# Altium project USBC.PrjPcb
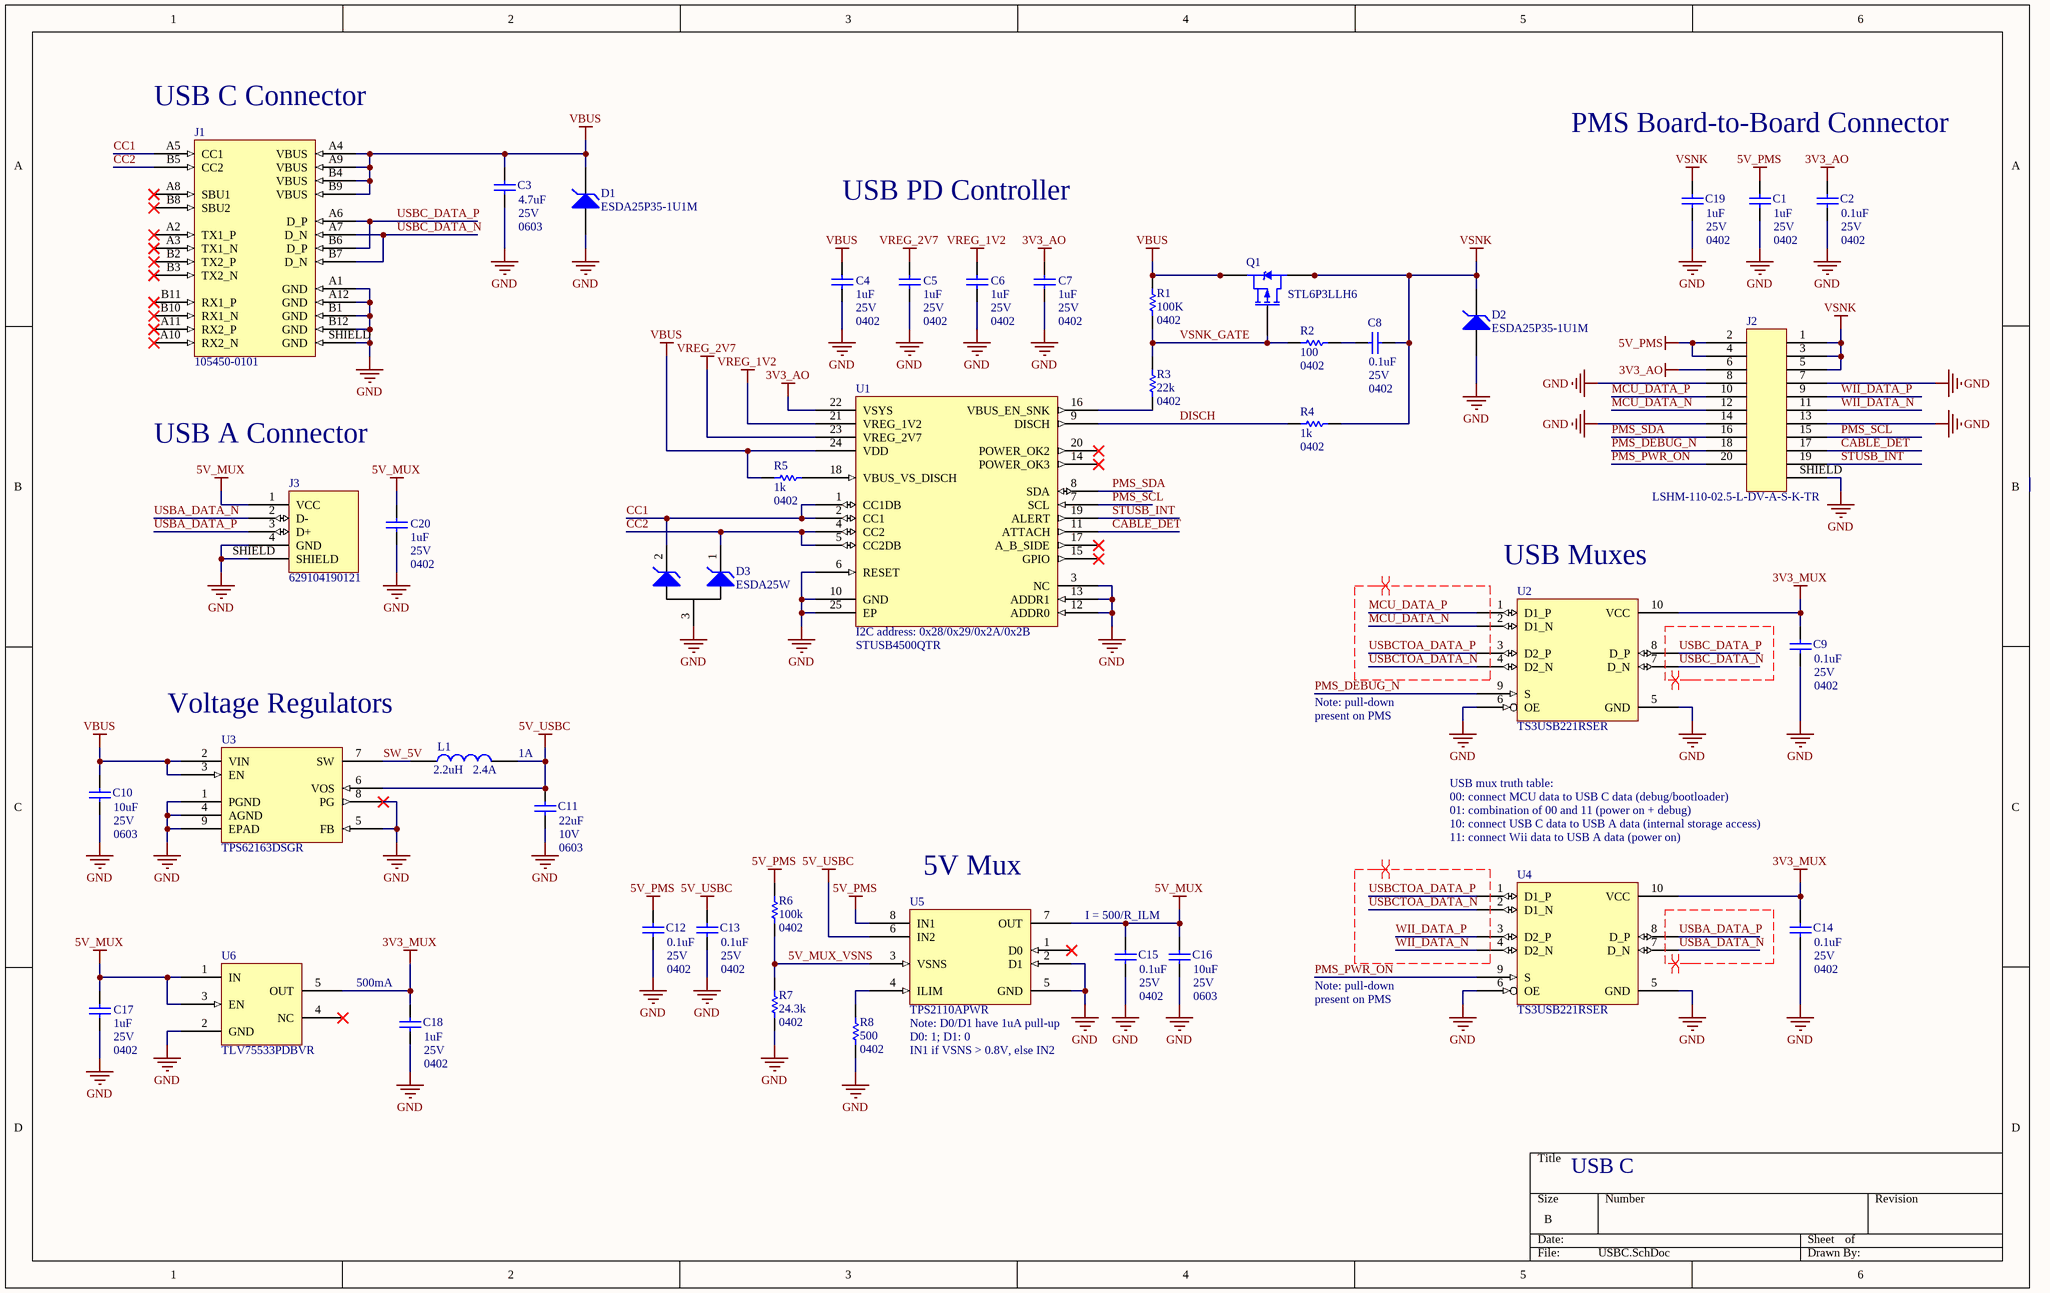
[diagram p0: USBC.SchDoc]
1 sheet, 42 parts. Net scope: global (net labels, ports and power ports of the same name join across sheets).
Board file: USBC.PcbDoc

## Sheet USBC.SchDoc
size B

### Parts
C1  value 1uF  Rated Voltage: 25V  Package: 0402  [CAPC1005X06N]  (hidden comment: Capacitor)
C2  value 0.1uF  Rated Voltage: 25V  Package: 0402  [CAPC1005X06N]  (hidden comment: Capacitor)
C3  value 4.7uF  Rated Voltage: 25V  Package: 0603  [CAPC1608X09N]  (hidden comment: Capacitor)
C4  value 1uF  Rated Voltage: 25V  Package: 0402  [CAPC1005X06N]  (hidden comment: Capacitor)
C5  value 1uF  Rated Voltage: 25V  Package: 0402  [CAPC1005X06N]  (hidden comment: Capacitor)
C6  value 1uF  Rated Voltage: 25V  Package: 0402  [CAPC1005X06N]  (hidden comment: Capacitor)
C7  value 1uF  Rated Voltage: 25V  Package: 0402  [CAPC1005X06N]  (hidden comment: Capacitor)
C8  value 0.1uF  Rated Voltage: 25V  Package: 0402  [CAPC1005X06N]  (hidden comment: Capacitor)
C9  value 0.1uF  Rated Voltage: 25V  Package: 0402  [CAPC1005X06N]  (hidden comment: Capacitor)
C10  value 10uF  Rated Voltage: 25V  Package: 0603  [CAPC1608X09N]  (hidden comment: Capacitor)
C11  value 22uF  Rated Voltage: 10V  Package: 0603  [CAPC1608X09N]  (hidden comment: Capacitor)
C12  value 0.1uF  Rated Voltage: 25V  Package: 0402  [CAPC1005X06N]  (hidden comment: Capacitor)
C13  value 0.1uF  Rated Voltage: 25V  Package: 0402  [CAPC1005X06N]  (hidden comment: Capacitor)
C14  value 0.1uF  Rated Voltage: 25V  Package: 0402  [CAPC1005X06N]  (hidden comment: Capacitor)
C15  value 0.1uF  Rated Voltage: 25V  Package: 0402  [CAPC1005X06N]  (hidden comment: Capacitor)
C16  value 10uF  Rated Voltage: 25V  Package: 0603  [CAPC1608X09N]  (hidden comment: Capacitor)
C17  value 1uF  Rated Voltage: 25V  Package: 0402  [CAPC1005X06N]  (hidden comment: Capacitor)
C18  value 1uF  Rated Voltage: 25V  Package: 0402  [CAPC1005X06N]  (hidden comment: Capacitor)
C19  value 1uF  Rated Voltage: 25V  Package: 0402  [CAPC1005X06N]  (hidden comment: Capacitor)
C20  value 1uF  Rated Voltage: 25V  Package: 0402  [CAPC1005X06N]  (hidden comment: Capacitor)
D1  ESDA25P35-1U1M  [DFN105P160X60-2N]
D2  ESDA25P35-1U1M  [DFN105P160X60-2N]
D3  ESDA25W  [SOT65P210X110-3N]
J1  105450-0101  [1054500101]
J2  LSHM-110-02.5-L-DV-A-S-K-TR  [LSHM-110-02.5-L-DV-A-S]
J3  629104190121  [629104190121]
L1  Current Rating: 2.4A  Inductance: 2.2uH  [INDC2520X10N]  (hidden comment: CIGT252010EH2R2MNE)
Q1  STL6P3LLH6  [QFN0P315X300X90-10N]
R1  value 100K  Package: 0402  [RESC1005X04N]  (hidden comment: Resistor)
R2  value 100  Package: 0402  [RESC1005X04N]  (hidden comment: Resistor)
R3  value 22k  Package: 0402  [RESC1005X04N]  (hidden comment: Resistor)
R4  value 1k  Package: 0402  [RESC1005X04N]  (hidden comment: Resistor)
R5  value 1k  Package: 0402  [RESC1005X04N]  (hidden comment: Resistor)
R6  value 100k  Package: 0402  [RESC1005X04N]  (hidden comment: Resistor)
R7  value 24.3k  Package: 0402  [RESC1005X04N]  (hidden comment: Resistor)
R8  value 500  Package: 0402  [RESC1005X04N]  (hidden comment: Resistor)
U1  STUSB4500QTR  [QFN50P400X400X100_HS-25N]
U2  TS3USB221RSER  [QFN50P150X200X60-10N]
U3  TPS62163DSGR  [SON50P200X80_HS-9N]
U4  TS3USB221RSER  [QFN50P150X200X60-10N]
U5  TPS2110APWR  [TSOP65P640X120-8N]
U6  TLV75533PDBVR  [SOT95P280X145-5N]

### Nets
3V3_AO: C2.2 C7.2 J2.6 U1.22(VSYS)
3V3_MUX: C9.2 C14.2 C18.2 U2.10(VCC) U4.10(VCC) U6.5(OUT)
5V_MUX: C15.2 C16.2 C17.2 C20.2 J3.1(VCC) U5.7(OUT) U6.1(IN) U6.3(EN)
5V_PMS: C1.2 C12.2 J2.2 J2.4 R6.2 U5.8(IN1)
5V_USBC: C11.2 C13.2 L1.2 U3.6(VOS) U5.6(IN2)
GND: C1.1 C2.1 C3.1 C4.1 C5.1 C6.1 C7.1 C9.1 C10.1 C11.1 C12.1 C13.1 C14.1 C15.1 C16.1 C17.1 C18.1 C19.1 C20.1 D1.2(A) D2.2(A) D3.3(A) J1.A1(GND) J1.A12(GND) J1.B1(GND) J1.B12(GND) J1.SHIELD(GND) J2.7 J2.8 J2.13 J2.14 J2.SHIELD J3.4(GND) J3.SHIELD R7.1 R8.1 U1.3(NC) U1.6(RESET) U1.10(GND) U1.12(ADDR0) U1.13(ADDR1) U1.25(EP) U2.5(GND) U2.6(OE) U3.1(PGND) U3.4(AGND) U3.5(FB) U3.8(PG) U3.9(EPAD) U4.5(GND) U4.6(OE) U5.2(D1) U5.5(GND) U6.2(GND)
VBUS: C3.2 C4.2 C10.2 D1.1(K) J1.A4(VBUS) J1.A9(VBUS) J1.B4(VBUS) J1.B9(VBUS) Q1.1(S) Q1.2(S) Q1.3(S) R1.2 R5.2 U1.24(VDD) U3.2(VIN) U3.3(EN)
VREG_1V2: C6.2 U1.21(VREG_1V2)
VREG_2V7: C5.2 U1.23(VREG_2V7)
VSNK: C8.1 C19.2 D2.1(K) J2.1 J2.3 J2.5 Q1.5(D) Q1.6(D) Q1.7(D) Q1.8(D) R4.1
5V_MUX_VSNS: R6.1 R7.2 U5.3(VSNS)
CABLE_DET: J2.17 U1.11(ATTACH)
CC1: D3.2(K2) J1.A5(CC1) U1.1(CC1DB) U1.2(CC1)
CC2: D3.1(K1) J1.B5(CC2) U1.4(CC2) U1.5(CC2DB)
DISCH: R4.2 U1.9(DISCH)
MCU_DATA_N: J2.12 U2.2(D1_N)
MCU_DATA_P: J2.10 U2.1(D1_P)
PMS_DEBUG_N: J2.18 U2.9(S)
PMS_PWR_ON: J2.20 U4.9(S)
PMS_SCL: J2.15 U1.7(SCL)
PMS_SDA: J2.16 U1.8(SDA)
STUSB_INT: J2.19 U1.19(ALERT)
SW_5V: L1.1 U3.7(SW)
USBA_DATA_N: J3.2(D-) U4.7(D_N)
USBA_DATA_P: J3.3(D+) U4.8(D_P)
USBC_DATA_N: J1.A7(D_N) J1.B7(D_N) U2.7(D_N)
USBC_DATA_P: J1.A6(D_P) J1.B6(D_P) U2.8(D_P)
USBCTOA_DATA_N: U2.4(D2_N) U4.2(D1_N)
USBCTOA_DATA_P: U2.3(D2_P) U4.1(D1_P)
VSNK_GATE: Q1.4(G) R1.1 R2.2 R3.2
WII_DATA_N: J2.11 U4.4(D2_N)
WII_DATA_P: J2.9 U4.3(D2_P)
NetC8_2: C8.2 R2.1
NetR3_1: R3.1 U1.16(VBUS_EN_SNK)
NetR5_1: R5.1 U1.18(VBUS_VS_DISCH)
NetR8_2: R8.2 U5.4(ILIM)

Not connected (* = marked no-connect by the designer): J1 A2(TX1_P)* A3(TX1_N)* A8(SBU1)* A10(RX2_N)* A11(RX2_P)* B2(TX2_P)* B3(TX2_N)* B8(SBU2)* B10(RX1_N)* B11(RX1_P)*; U1 14(POWER_OK3)* 15(GPIO)* 17(A_B_SIDE)* 20(POWER_OK2)*; U5 1(D0)*; U6 4(NC)*

### Layout directives
differential pair: MCU_DATA_N, MCU_DATA_P, USBA_DATA_N, USBA_DATA_P, USBC_DATA_N, USBC_DATA_P, USBCTOA_DATA_N, USBCTOA_DATA_P, WII_DATA_N, WII_DATA_P

### Notes on the sheet
- (near J1) USB C Connector
- PMS Board-to-Board Connector
- USB PD Controller
- USB A Connector
- (near U2) USB Muxes
- Voltage Regulators
- 1A
- Note: pull-down
  present on PMS
- USB mux truth table:
  00: connect MCU data to USB C data (debug/bootloader)
  01: combination of 00 and 11 (power on + debug)
  10: connect USB C data to USB A data (internal storage access)
  11: connect Wii data to USB A data (power on)
- (near U5) 5V Mux
- I = 500/R_ILM
- 500mA
- (near U5) Note: D0/D1 have 1uA pull-up
- D0: 1; D1: 0
- IN1 if VSNS > 0.8V, else IN2
- USB C
- (in symbol STUSB4500QTR) I2C address: 0x28/0x29/0x2A/0x2B

### Library data of the parts
C1-C20 = Capacitor: General purpose capacitor
D1 D2 = ESDA25P35-1U1M: STMICROELECTRONICS - ESDA25P35-1U1M - ESD Protection Device, Unidirectional, 41 V, QFN, 2 Pins; Number of Unidirectional Channels: 1; Reverse Standoff Voltage: 22V; Min Breakdown Voltage: 23.3V; Clamping Voltage: 41V; Peak Pulse Current: 35A; Peak Pulse Power: 1.4kW; Power Line Protection: No; Supplier 1: Digi-Key; Manufacturer: STMicroelectronics; Manufacturer Part Number: ESDA25P35-1U1M; RoHS: No; Category: TVS Diodes; Stock 1: 4234; Pricing 1: 1=0.45000, 10=0.36200, 25=0.33120, 100=0.20790, 250=0.20560, 500=0.19250, 1000=0.13090, 2500=0.12551 (USD); Mount: Surface Mount; Case/Package: 1610; Number of Pins: 2; Min Operating Temperature: -55°C; Max Operating Temperature: 150°C; Composition: Zener; Packaging: Tape and Reel; ComponentLink1URL: http://www.farnell.com/datasheets/2236209.pdf?src-supplier=Farnell; ComponentLink1Description: http://www.farnell.com/datasheets/2236209.pdf?src-supplier=Farnell; ComponentLink2URL: http://www.st.com/content/ccc/resource/technical/document/datasheet/group3/e4/43/53/b9/4e/8a/40/bb/DM00312034/files/DM00312034.pdf/jcr:content/translations/en.DM00312034.pdf?src-supplier=Digi-Key; ComponentLink2Description: http://www.st.com/content/ccc/resource/technical/document/datasheet/group3/e4/43/53/b9/4e/8a/40/bb/DM00312034/files/DM00312034.pdf/jcr:content/translations/en.DM00312034.pdf?src-supplier=Digi-Key; ComponentLink3URL: http://www.farnell.com/datasheets/2236209.pdf?src-supplier=Element14; ComponentLink3Description: http://www.farnell.com/datasheets/2236209.pdf?src-supplier=Element14; ComponentLink4URL: http://www.farnell.com/datasheets/2236209.pdf?src-supplier=Newark; ComponentLink4Description: http://www.farnell.com/datasheets/2236209.pdf?src-supplier=Newark
D3 = ESDA25W: STMICROELECTRONICS - ESDA25W - ESD Protection Device, Array, SOT-323, 3 Pins, 1.2 V, 400 W, ESDA2 Series; Working Voltage: 24V; Direction: Unidirectional; Number of Channels: 2; Min Breakdown Voltage: 25V; Peak Pulse Power: 400W; Power Line Protection: No; Leakage Current: 1uA; ESD Protection: Yes; Test Current: 1mA; Max Breakdown Voltage: 30V; Element Configuration: Common Anode; Capacitance: 65pF; Operating Supply Voltage: 1.2V; Supplier 1: Digi-Key; Manufacturer: STMicroelectronics; Manufacturer Part Number: ESDA25W; RoHS: Yes; Category: Integrated Circuits (ICs); Pricing 1: 1=0.40000, 10=0.32600, 25=0.29800, 100=0.18710, 250=0.18504, 500=0.17326, 1000=0.11781 (USD); Mount: Surface Mount; Case/Package: SOT-323; Number of Pins: 3; Min Operating Temperature: -40°C; Max Operating Temperature: 125°C; Composition: Zener; Number of Unidirectional Channels: 2; Reverse Standoff Voltage: 24V; Polarity: Unidirectional; Breakdown Voltage: 25V; Termination: SMD/SMT; Max Reverse Leakage Current: 1uA; Voltage Rating (DC): 25V; Package Quantity: 1; Packaging: Tape and Reel; Number of Elements: 2; Reverse Breakdown Voltage: 25V; Max Power Dissipation: 400W; Length: 2mm; Height: 1.1mm; Depth: 1.25mm; Width: 1.25mm; Radiation Hardening: No; Lead Free: Lead Free; REACH SVHC: No SVHC; ComponentLink1URL: https://datasheet.ciiva.com/15143/getdatasheetpartid-144665-15143734.pdf?src-supplier=Verical; ComponentLink1Description: https://datasheet.ciiva.com/15143/getdatasheetpartid-144665-15143734.pdf?src-supplier=Verical; ComponentLink2URL: https://datasheet.ciiva.com/16216/cd00064033-16216903.pdf?src-supplier=Future+Electronics; ComponentLink2Description: https://datasheet.ciiva.com/16216/cd00064033-16216903.pdf?src-supplier=Future+Electronics; ComponentLink3URL: https://datasheet.ciiva.com/26787/esda25w-26787589.pdf?src-supplier=IIIC; ComponentLink3Description: https://datasheet.ciiva.com/26787/esda25w-26787589.pdf?src-supplier=IIIC; ComponentLink4URL: https://datasheet.ciiva.com/338/cd00064033-338272.pdf?src-supplier=Digi-Key; ComponentLink4Description: https://datasheet.ciiva.com/338/cd00064033-338272.pdf?src-supplier=Digi-Key; ComponentLink5URL: https://datasheet.ciiva.com/338/cd00064033-338273.pdf?src-supplier=Digi-Key; ComponentLink5Description: https://datasheet.ciiva.com/338/cd00064033-338273.pdf?src-supplier=Digi-Key; ComponentLink6URL: https://datasheet.ciiva.com/4510/cd00064033-4510575.pdf?src-supplier=Mouser; ComponentLink6Description: https://datasheet.ciiva.com/4510/cd00064033-4510575.pdf?src-supplier=Mouser; ComponentLink7URL: https://datasheet.ciiva.com/28474/1671027-28474846.pdf?src-supplier=Element14; ComponentLink7Description: https://datasheet.ciiva.com/28474/1671027-28474846.pdf?src-supplier=Element14; ComponentLink8URL: https://datasheet.ciiva.com/338/cd00064033-338271.pdf?src-supplier=Digi-Key; ComponentLink8Description: https://datasheet.ciiva.com/338/cd00064033-338271.pdf?src-supplier=Digi-Key
J1 = 105450-0101: USB Shielded I/O Receptacle; Type C; Right Angle; Surface Mount; Gold over Nickel; Manufacturer: Molex; USB Standard: USB 3.1; Number of Contacts: 24; Number of Ports: 1; Current Rating: 5A; Mating Cycles: 10000; Pitch: 0.5mm; Supplier 1: Digi-Key; Manufacturer Part Number: 105450-0101; RoHS: Yes; Category: Connectors; Stock 1: 5403; Pricing 1: 1=2.15000, 10=1.94900, 25=1.82960, 50=1.75000, 100=1.67050, 250=1.51140, 500=1.39208 (USD); Mount: Surface Mount,Through Hole,Horizontal; Case/Package: 0101; Number of Pins: 24; Contact Material: Copper Alloy; Contact Plating: Gold; Number of Terminals: 24; Insulation Color: Black; Housing Material: Thermoplastic; Min Operating Temperature: -30°C; Max Operating Temperature: 85°C; Packaging: Tape and Reel; Connector Type: USB; Gender: Receptacle; Termination: Solder; Orientation: Right Angle; Shielding: Shielded; Features: Shielded; Length: 8.94mm; REACH SVHC: Unknown; Flammability Rating: UL94 V-0; ComponentLink1URL: http://www.farnell.com/datasheets/2801634.pdf?src-supplier=Farnell; ComponentLink1Description: http://www.farnell.com/datasheets/2801634.pdf?src-supplier=Farnell; ComponentLink2URL: http://www.farnell.com/datasheets/2672741.pdf?src-supplier=Newark; ComponentLink2Description: http://www.farnell.com/datasheets/2672741.pdf?src-supplier=Newark; ComponentLink3URL: http://www.farnell.com/datasheets/2015275.pdf?src-supplier=Element14; ComponentLink3Description: http://www.farnell.com/datasheets/2015275.pdf?src-supplier=Element14; ComponentLink4URL: https://www.molex.com/pdm_docs/ps/PS-105448-001.pdf?src-supplier=Digi-Key; ComponentLink4Description: https://www.molex.com/pdm_docs/ps/PS-105448-001.pdf?src-supplier=Digi-Key; ComponentLink5URL: http://www.farnell.com/datasheets/2801634.pdf?src-supplier=Newark; ComponentLink5Description: http://www.farnell.com/datasheets/2801634.pdf?src-supplier=Newark; ComponentLink6URL: https://www.molex.com/pdm_docs/sd/1054500101_sd.pdf?src-supplier=Digi-Key; ComponentLink6Description: https://www.molex.com/pdm_docs/sd/1054500101_sd.pdf?src-supplier=Digi-Key; ComponentLink7URL: http://www.farnell.com/datasheets/2801634.pdf?src-supplier=Element14; ComponentLink7Description: http://www.farnell.com/datasheets/2801634.pdf?src-supplier=Element14; ComponentLink8URL: http://www.literature.molex.com/SQLImages/kelmscott/Molex/PDF_Images/987651-4081.PDF?src-supplier=Avnet; ComponentLink8Description: http://www.literature.molex.com/SQLImages/kelmscott/Molex/PDF_Images/987651-4081.PDF?src-supplier=Avnet; ComponentLink9URL: http://www.literature.molex.com/SQLImages/kelmscott/Molex/PDF_Images/987651-4081.PDF?src-supplier=Avnet+Asia; ComponentLink9Description: http://www.literature.molex.com/SQLImages/kelmscott/Molex/PDF_Images/987651-4081.PDF?src-supplier=Avnet+Asia
J2 = LSHM-110-02.5-L-DV-A-S-K-TR: HERMAPHRODITIC 0.50MM SMD 20POS 2.5MM; Manufacturer: Samtec; Connector Type: Non-Gendered; Number of Positions: 20; Mated Stacking Heights: 8.5mm; Supplier 1: Digi-Key; Manufacturer Part Number: LSHM-110-02.5-L-DV-A-S-K-TR; RoHS: No; Stock 1: 1318; Pricing 1: 1=5.89000, 10=5.65000, 25=5.17880, 50=4.94340, 100=4.70800, 250=4.11952 (USD); Mount: Surface Mount; Contact Plating: Gold; Features: Shielded; Packaging: Tape and Reel; Number of Rows: 2; ComponentLink1URL: http://suddendocs.samtec.com/prints/lshm-1xx-xx.x-xx-dv-a-x-x-tr-mkt.pdf?src-supplier=Digi-Key; ComponentLink1Description: http://suddendocs.samtec.com/prints/lshm-1xx-xx.x-xx-dv-a-x-x-tr-mkt.pdf?src-supplier=Digi-Key
J3 = 629104190121: WURTH ELEKTRONIK - 629104190121 - USB Connector, USB Type A, USB 2.0, Receptacle, 4 Positions, Surface Mount, Horizontal; Manufacturer: Wurth Electronics; Number of Contacts: 4; Number of Ports: 1; Current Rating: 1.5A; Mating Cycles: 1500; Shielding: Shielded; Supplier 1: Digi-Key; Manufacturer Part Number: 629104190121; RoHS: No; Stock 1: 8348; Pricing 1: 1=1.41000, 10=1.18000, 50=1.03000, 100=0.94000 (USD); Mount: Surface Mount; Contact Plating: Gold; Insulation Color: Black; Min Operating Temperature: -40°C; Max Operating Temperature: 85°C; Connector Type: USB; Packaging: Cut Tape; Gender: Receptacle; Termination: Solder; Flammability Rating: UL94 V-0; ComponentLink1URL: https://katalog.we-online.de/em/datasheet/629104190121.pdf?src-supplier=Digi-Key; ComponentLink1Description: https://katalog.we-online.de/em/datasheet/629104190121.pdf?src-supplier=Digi-Key
L1 = CIGT252010EH2R2MNE: FIXED IND 2.2UH 2.4A 80MOHM SMD; Manufacturer: Samsung; Core Material: Metal,Composite; Tolerance: 20%; Saturation Current: 2.7A; Shielding: Unshielded; DC Resistance (DCR): 80mR; Test Frequency: 1MHz; Supplier 1: Digi-Key; Manufacturer Part Number: CIGT252010EH2R2MNE; RoHS: No; Stock 1: 35283; Pricing 1: 1=0.28000, 10=0.25300, 100=0.17390, 500=0.14864, 1000=0.11385 (USD); Mount: Surface Mount; Case/Package: 1008; Case Code (Imperial): 1008; Case Code (Metric): 2520; Min Operating Temperature: -40°C; Max Operating Temperature: 125°C; Composition: Thin Film; Packaging: Tape and Reel; ComponentLink1URL: http://www.samsungsem.com/kr/support/product-search/inductor/CIGT252010EH2R2MNE.jsp?src-supplier=Digi-Key; ComponentLink1Description: http://www.samsungsem.com/kr/support/product-search/inductor/CIGT252010EH2R2MNE.jsp?src-supplier=Digi-Key
Q1 = STL6P3LLH6: MOSFET POWER MOSFET; Manufacturer: STMicroelectronics; Drain to Source Voltage (Vdss): 30V; Continuous Drain Current (ID): 6A; Rds On Max: 30mR; Input Capacitance: 1.45nF; Max Power Dissipation: 2.9W; Supplier 1: Digi-Key; Manufacturer Part Number: STL6P3LLH6; RoHS: Yes; Category: MOSFETs; Stock 1: 129; Pricing 1: 1=1.45000, 10=1.29800, 25=1.23200, 100=0.92400, 250=0.91520, 500=0.78320, 1000=0.63800 (USD); Mount: Surface Mount; Number of Pins: 8; Packaging: Tape and Reel; Lead Free: Lead Free; ComponentLink1URL: http://www.mouser.com/ds/2/389/stl6p3llh6-956152.pdf?src-supplier=Mouser; ComponentLink1Description: http://www.mouser.com/ds/2/389/stl6p3llh6-956152.pdf?src-supplier=Mouser; ComponentLink2URL: http://www.st.com/content/ccc/resource/technical/document/datasheet/3c/90/16/29/a8/76/48/02/DM00064617.pdf/files/DM00064617.pdf/jcr:content/translations/en.DM00064617.pdf?src-supplier=Digi-Key; ComponentLink2Description: http://www.st.com/content/ccc/resource/technical/document/datasheet/3c/90/16/29/a8/76/48/02/DM00064617.pdf/files/DM00064617.pdf/jcr:content/translations/en.DM00064617.pdf?src-supplier=Digi-Key; ComponentLink3URL: http://www.st.com/st-web-ui/static/active/en/resource/technical/document/datasheet/DM00064617.pdf?src-supplier=Avnet; ComponentLink3Description: http://www.st.com/st-web-ui/static/active/en/resource/technical/document/datasheet/DM00064617.pdf?src-supplier=Avnet
R1-R8 = Resistor: General purpose resistor
U1 = STUSB4500QTR: STAND-ALONE USB PD CONTROLLER (; Manufacturer: STMicroelectronics; Interface: I2C; Supplier 1: Mouser; Manufacturer Part Number: STUSB4500QTR; RoHS: No; Stock 1: 6187; Pricing 1: 1=2.11000, 10=1.79000, 100=1.43000, 500=1.25000, 1000=1.04000, 4000=0.93500, 8000=0.89900, 24000=0.86400 (USD); Case/Package: QFN; Min Operating Temperature: -40°C; Max Operating Temperature: 105°C; Packaging: Tape and Reel; ComponentLink1URL: http://www.farnell.com/datasheets/2710898.pdf?src-supplier=Farnell; ComponentLink1Description: http://www.farnell.com/datasheets/2710898.pdf?src-supplier=Farnell; ComponentLink2URL: http://www.farnell.com/datasheets/2710898.pdf?src-supplier=Newark; ComponentLink2Description: http://www.farnell.com/datasheets/2710898.pdf?src-supplier=Newark; ComponentLink3URL: http://www.st.com/content/ccc/resource/technical/document/datasheet/group3/1c/4a/55/d7/17/01/44/86/DM00489312/files/DM00489312.pdf/jcr:content/translations/en.DM00489312.pdf?src-supplier=Digi-Key; ComponentLink3Description: http://www.st.com/content/ccc/resource/technical/document/datasheet/group3/1c/4a/55/d7/17/01/44/86/DM00489312/files/DM00489312.pdf/jcr:content/translations/en.DM00489312.pdf?src-supplier=Digi-Key; ComponentLink4URL: http://www.farnell.com/datasheets/2710898.pdf?src-supplier=Element14; ComponentLink4Description: http://www.farnell.com/datasheets/2710898.pdf?src-supplier=Element14
U2 U4 = TS3USB221RSER: TEXAS INSTRUMENTS         TS3USB221RSER.             USB SWITCH, 480MBPS, 1.1GHZ, QFN-10; Number of Channels: 2; Min Supply Voltage: 2.3V; Max Supply Voltage: 3.6V; On-State Resistance: 6R; Number of Inputs: 4; Operating Supply Voltage: 3V; Nominal Supply Current: 30uA; Turn-Off Delay Time: 12ns; Turn-On Delay Time: 30ns; Supply Type: Single; USB Standard: USB 2.0; High Level Output Current: 64mA; Supplier 1: Digi-Key; Manufacturer: Texas Instruments; Manufacturer Part Number: TS3USB221RSER; RoHS: Yes; Category: USB Interface ICs; Stock 1: 22769; Pricing 1: 1=1.12000, 10=1.00300, 25=0.95200, 100=0.73100, 250=0.64600, 500=0.61200, 1000=0.47600 (USD); Case/Package: QFN; Number of Pins: 10; Weight: 0.000247oz; Contact Plating: Gold; Min Operating Temperature: -40°C; Max Operating Temperature: 85°C; Data Rate: 480Mbps; Packaging: Tape and Reel; Bandwidth: 1.1GHz; Number of Outputs: 2; Package Quantity: 1; Operating Supply Current: 30uA; Number of Ports: 2; Length: 1.5mm; Height: 0.55mm; Width: 2mm; Radiation Hardening: No; Lead Free: Lead Free; REACH SVHC: No SVHC; ComponentLink1URL: https://datasheet.ciiva.com/4924/scds220g-126796-4924322.pdf?src-supplier=Mouser; ComponentLink1Description: https://datasheet.ciiva.com/4924/scds220g-126796-4924322.pdf?src-supplier=Mouser; ComponentLink2URL: https://datasheet.ciiva.com/1505/1805933-1505289.pdf?src-supplier=Element14; ComponentLink2Description: https://datasheet.ciiva.com/1505/1805933-1505289.pdf?src-supplier=Element14; ComponentLink3URL: https://datasheet.ciiva.com/15126/getdatasheetpartid-48047-15126909.pdf?src-supplier=Verical; ComponentLink3Description: https://datasheet.ciiva.com/15126/getdatasheetpartid-48047-15126909.pdf?src-supplier=Verical; ComponentLink4URL: https://datasheet.ciiva.com/41461/001187309-da-01-en-ic-usb-switch-ts3usb221rser-uqfn-10-tid-41461683.pdf?src-supplier=Conrad; ComponentLink4Description: https://datasheet.ciiva.com/41461/001187309-da-01-en-ic-usb-switch-ts3usb221rser-uqfn-10-tid-41461683.pdf?src-supplier=Conrad; ComponentLink5URL: https://datasheet.ciiva.com/1672/ts3usb221-1672054.pdf?src-supplier=Digi-Key; ComponentLink5Description: https://datasheet.ciiva.com/1672/ts3usb221-1672054.pdf?src-supplier=Digi-Key; ComponentLink6URL: https://datasheet.ciiva.com/6636/ts3usb221-6636809.pdf?src-supplier=Digi-Key; ComponentLink6Description: https://datasheet.ciiva.com/6636/ts3usb221-6636809.pdf?src-supplier=Digi-Key; ComponentLink7URL: https://datasheet.ciiva.com/1505/1882068-1505181.pdf?src-supplier=Element14; ComponentLink7Description: https://datasheet.ciiva.com/1505/1882068-1505181.pdf?src-supplier=Element14; ComponentLink8URL: https://datasheet.ciiva.com/1672/ts3usb221-1672053.pdf?src-supplier=Digi-Key; ComponentLink8Description: https://datasheet.ciiva.com/1672/ts3usb221-1672053.pdf?src-supplier=Digi-Key; ComponentLink9URL: https://datasheet.ciiva.com/22694/1882068-22694357.pdf?src-supplier=Element14; ComponentLink9Description: https://datasheet.ciiva.com/22694/1882068-22694357.pdf?src-supplier=Element14
U3 = TPS62163DSGR: 3V-17V 1A Step-Down Converters with DCS-Control? 8-WSON -40 to 125; Manufacturer: Texas Instruments; Max Input Voltage: 17V; Min Input Voltage: 3V; Number of Outputs: 1; Output Voltage: 5V; Output Type: Fixed; Quiescent Current: 17uA; Synchronous Rectifier: Yes; Switching Frequency: 2.25MHz; Output Configuration: Positive; Supplier 1: Digi-Key; Manufacturer Part Number: TPS62163DSGR; RoHS: Yes; Category: Power Supply Modules; Stock 1: 10746; Pricing 1: 1=1.58000, 10=1.42300, 25=1.34240, 100=1.07400, 250=0.93976, 500=0.91290, 1000=0.72495 (USD); Case/Package: SOIC; Number of Pins: 8; Contact Plating: Gold; Min Operating Temperature: -40°C; Max Operating Temperature: 125°C; Operating Supply Voltage: 17V; Max Output Current: 1A; Packaging: Tape and Reel; Package Quantity: 1; Min Output Voltage: 5V; Max Output Voltage: 5V; Output Current: 1A; Lead Free: Lead Free; REACH SVHC: No SVHC; ComponentLink1URL: https://datasheet.ciiva.com/4880/slvsam2a-198231-4880752.pdf?src-supplier=Mouser; ComponentLink1Description: https://datasheet.ciiva.com/4880/slvsam2a-198231-4880752.pdf?src-supplier=Mouser; ComponentLink2URL: https://datasheet.ciiva.com/2034/tps62160-2034672.pdf?src-supplier=Digi-Key; ComponentLink2Description: https://datasheet.ciiva.com/2034/tps62160-2034672.pdf?src-supplier=Digi-Key; ComponentLink3URL: https://datasheet.ciiva.com/2034/tps62160-2034673.pdf?src-supplier=Digi-Key; ComponentLink3Description: https://datasheet.ciiva.com/2034/tps62160-2034673.pdf?src-supplier=Digi-Key; ComponentLink4URL: https://datasheet.ciiva.com/2034/tps62160-2034674.pdf?src-supplier=Digi-Key; ComponentLink4Description: https://datasheet.ciiva.com/2034/tps62160-2034674.pdf?src-supplier=Digi-Key
U5 = TPS2110APWR: IC OR CTRLR SRC SELECT 8TSSOP; Manufacturer: Texas Instruments; Max Input Voltage: 5.5V; Min Input Voltage: 2.8V; Turn-On Delay Time: 500us; Current - Output 2: 750mA; Number of Inputs: 2; Number of Outputs: 1; On-State Resistance: 120mR; Output Voltage: 6V; Supplier 1: Digi-Key; Manufacturer Part Number: TPS2110APWR; RoHS: Yes; Category: Voltage Regulators - Switching; Stock 1: 4089; Pricing 1: 1=2.34000, 10=2.09900, 25=1.98000, 100=1.58400, 250=1.38600, 500=1.34640, 1000=1.06920 (USD); Case/Package: TSSOP; Number of Pins: 8; Weight: 0.001376oz; Min Operating Temperature: -40°C; Max Operating Temperature: 85°C; Operating Supply Voltage: 5.5V; Output Current: 750mA; Packaging: Tape and Reel; Package Quantity: 1; Max Output Current: 750mA; Radiation Hardening: No; Lead Free: Lead Free; REACH SVHC: No SVHC; ComponentLink1URL: https://datasheet.ciiva.com/15109/getdatasheetpartid-508751-15109281.pdf?src-supplier=Verical; ComponentLink1Description: https://datasheet.ciiva.com/15109/getdatasheetpartid-508751-15109281.pdf?src-supplier=Verical; ComponentLink2URL: https://datasheet.ciiva.com/3232/tps2110a-3232502.pdf?src-supplier=Avnet; ComponentLink2Description: https://datasheet.ciiva.com/3232/tps2110a-3232502.pdf?src-supplier=Avnet; ComponentLink3URL: https://datasheet.ciiva.com/1960/tps2110a-1960807.pdf?src-supplier=Digi-Key; ComponentLink3Description: https://datasheet.ciiva.com/1960/tps2110a-1960807.pdf?src-supplier=Digi-Key; ComponentLink4URL: https://datasheet.ciiva.com/1960/tps2110a-1960808.pdf?src-supplier=Digi-Key; ComponentLink4Description: https://datasheet.ciiva.com/1960/tps2110a-1960808.pdf?src-supplier=Digi-Key; ComponentLink5URL: https://datasheet.ciiva.com/1960/tps2110a-1960809.pdf?src-supplier=Digi-Key; ComponentLink5Description: https://datasheet.ciiva.com/1960/tps2110a-1960809.pdf?src-supplier=Digi-Key
U6 = TLV75533PDBVR: IC REG LINEAR 3.3V 500MA SOT23-5; Manufacturer: Texas Instruments; Supplier 1: Digi-Key; Manufacturer Part Number: TLV75533PDBVR; Stock 1: 25120; Pricing 1: 1=0.63000, 10=0.55100, 100=0.39250, 500=0.31730, 1000=0.24215 (USD); RoHS: No; Min Operating Temperature: -40°C; Max Operating Temperature: 125°C; ComponentLink1URL: http://www.ti.com/lit/ds/symlink/tlv755p.pdf?src-supplier=Digi-Key; ComponentLink1Description: http://www.ti.com/lit/ds/symlink/tlv755p.pdf?src-supplier=Digi-Key